# EAGLE design BlinkyTile_controller (EAGLE 7.1.0)
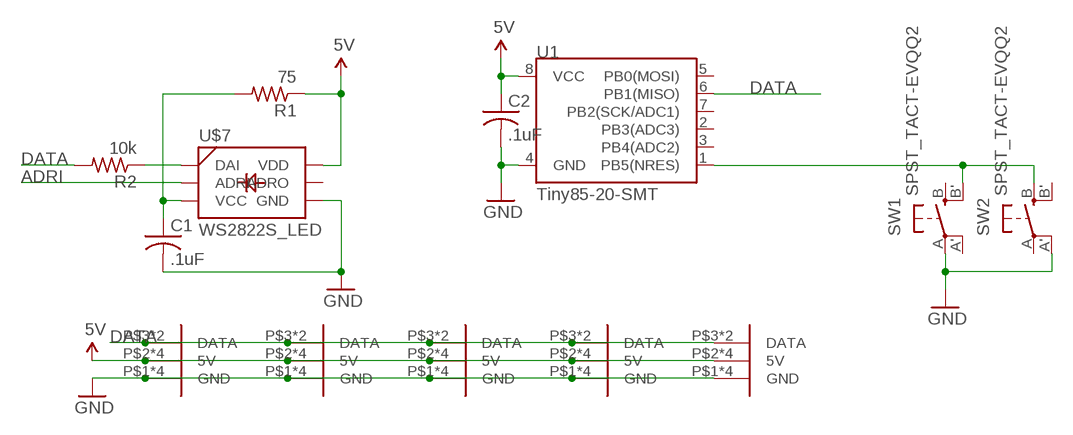
[diagram p0: schematic, sheet 1]

## Parts
C1  .1uF  C-USC0603  [C0603]
C2  .1uF  C-USC0603  [C0603]
R1  75  R-US_R0603  [R0603]
R2  10k  R-US_R0603  [R0603]
SW1  SPST_TACT-EVQQ2  [EVQ-Q2]
SW2  SPST_TACT-EVQQ2  [EVQ-Q2]
U1  Tiny85-20-SMT  ATTINY45TINY85-20-SMT  [SO08-EIAJ]
U$2  D_EDGESLOT  [D_EDGE_SLOT]
U$3  D_EDGESLOT  [D_EDGE_SLOT]
U$4  D_EDGESLOT  [D_EDGE_SLOT]
U$5  D_EDGESLOT  [D_EDGE_SLOT]
U$6  D_EDGESLOT  [D_EDGE_SLOT]
U$7  WS2822S_LED  [WS2822S_LED]

## Nets
5V: C2.1 R1.1 U1.8(VCC) U$2.P$2(5V) U$2.P$4(5V) U$2.P$7(5V) U$2.P$9(5V) U$3.P$2(5V) U$3.P$4(5V) U$3.P$7(5V) U$3.P$9(5V) U$4.P$2(5V) U$4.P$4(5V) U$4.P$7(5V) U$4.P$9(5V) U$5.P$2(5V) U$5.P$4(5V) U$5.P$7(5V) U$5.P$9(5V) U$6.P$2(5V) U$6.P$4(5V) U$6.P$7(5V) U$6.P$9(5V) U$7.6(VDD)
ADRI: U$7.2(ADRI)
DATA: R2.2 U1.6(PB1(MISO)) U$2.P$3(DATA) U$2.P$8(DATA) U$3.P$3(DATA) U$3.P$8(DATA) U$4.P$3(DATA) U$4.P$8(DATA) U$5.P$3(DATA) U$5.P$8(DATA) U$6.P$3(DATA) U$6.P$8(DATA)
GND: C1.2 C2.2 SW1.A(P) SW2.A'(P1) U1.4(GND) U$2.P$1(GND) U$2.P$5(GND) U$2.P$6(GND) U$2.P$10(GND) U$3.P$1(GND) U$3.P$5(GND) U$3.P$6(GND) U$3.P$10(GND) U$4.P$1(GND) U$4.P$5(GND) U$4.P$6(GND) U$4.P$10(GND) U$5.P$1(GND) U$5.P$5(GND) U$5.P$6(GND) U$5.P$10(GND) U$6.P$1(GND) U$6.P$5(GND) U$6.P$6(GND) U$6.P$10(GND) U$7.4(GND)
N$1: C1.1 R1.2 U$7.3(VCC)
N$2: R2.1 U$7.1(DAI)
N$3: SW1.B'(S1) SW2.B(S) U1.1(PB5(NRES))
Unconnected: SW1.A'(P1) SW1.B(S) SW2.A(P) SW2.B'(S1) U1.2(PB3(ADC3)) U1.3(PB4(ADC2)) U1.5(PB0(MOSI)) U1.7(PB2(SCK/ADC1)) U$7.5(ADRO)

## Library data of the parts
C1 C2 = adafruit:C-US: CAPACITOR, American symbol
R1 R2 = adafruit:R-US_: RESISTOR, American symbol
SW1 SW2 = adafruit:SPST_TACT: SMT 6mm switch, EVQQ2 series http://www.ladyada.net/library/eagle
U1 = SparkFun-DigitalIC:ATTINY45: Atmel 8-pin 2/4/8kB flash uC; PROD_ID: IC-09092
U$2-U$6 = dodocohedreled:D_EDGE
U$7 = blinkinlabs:WS2822S_LED

## Board
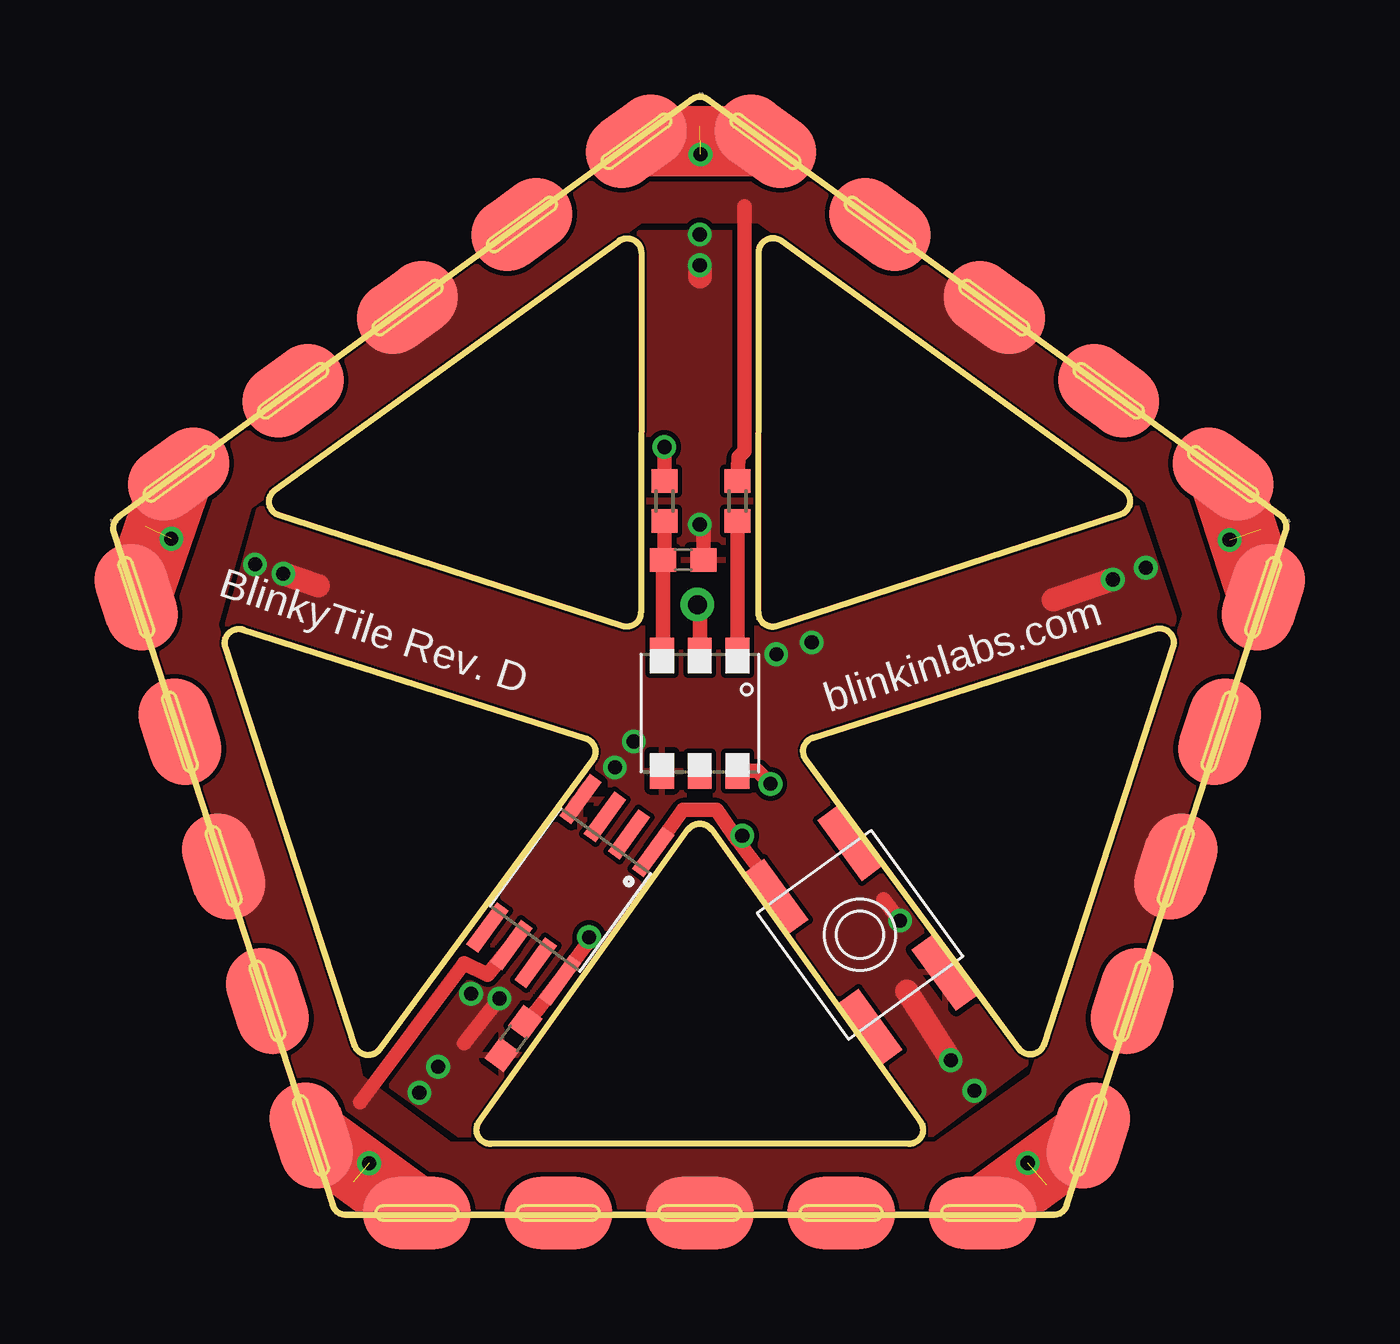
[diagram p1: board, top side]
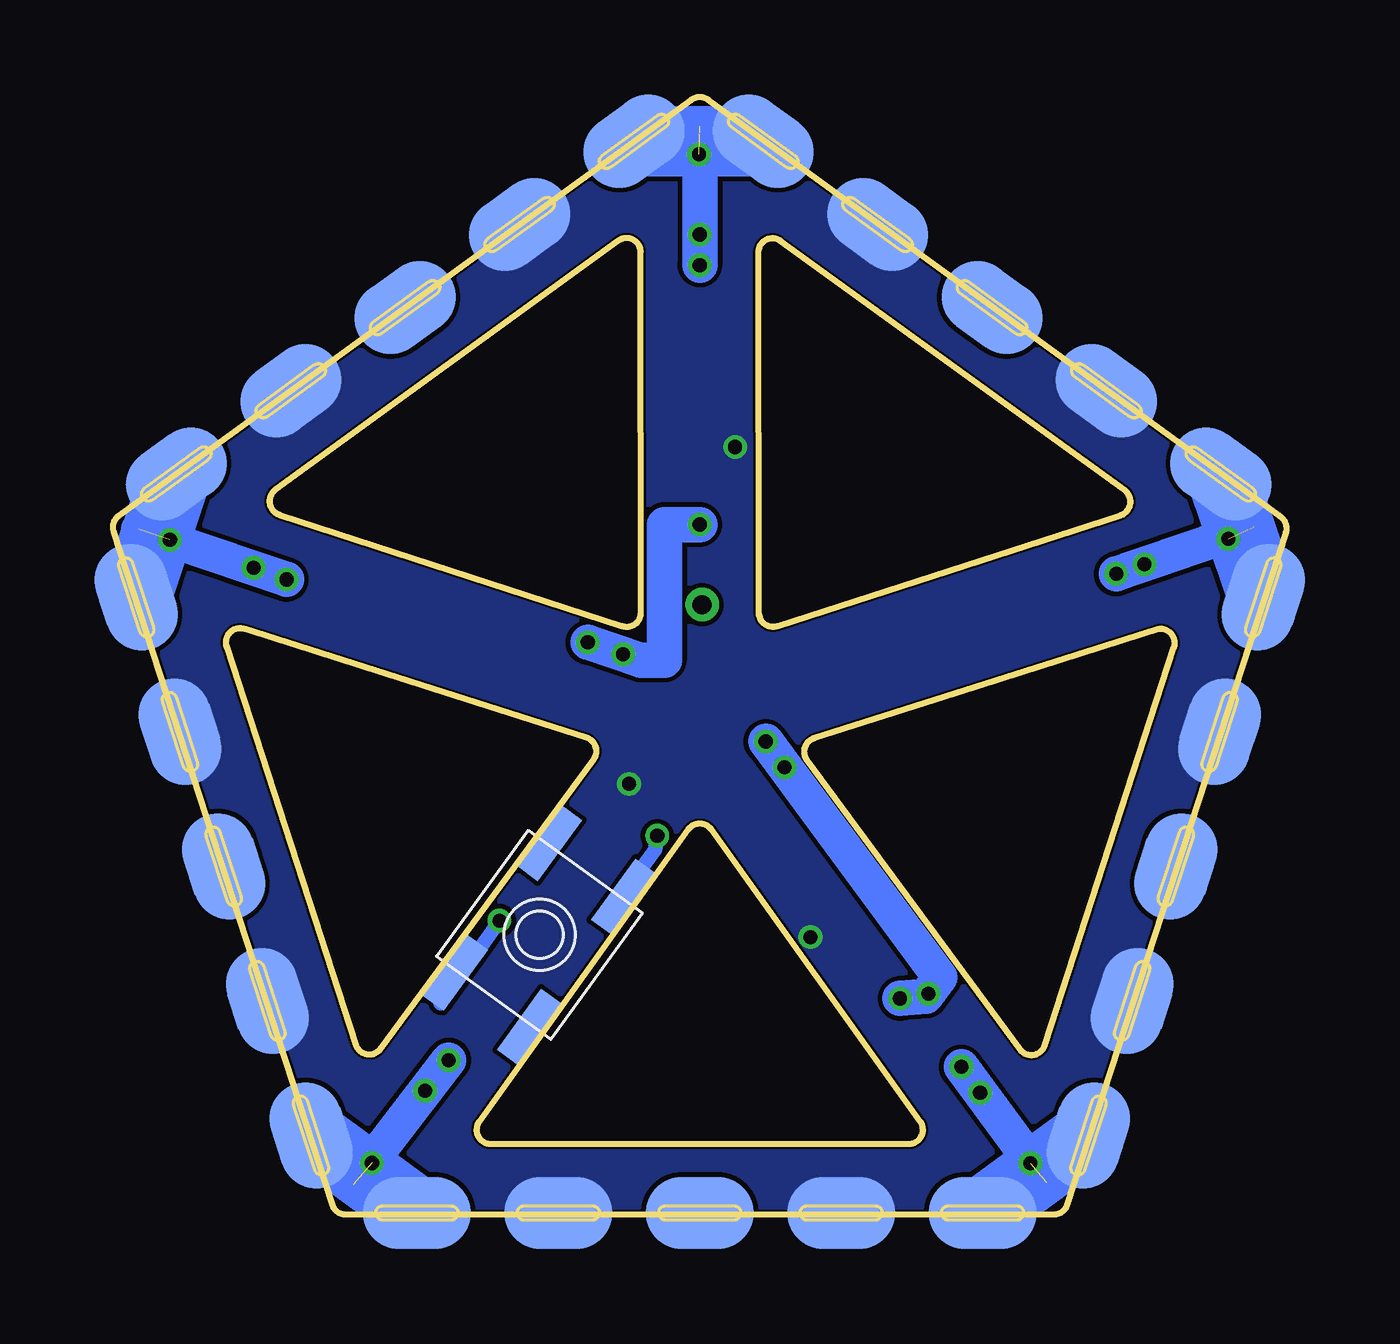
[diagram p2: board, bottom side, seen from below]

Size 49.79 x 47.41 mm. Coordinates in mm from the lower left corner, seen from the top.
Outline: 0.03,28.93 9.31,0.41 arc72 9.88,0 39.91,0 arc72 40.48,0.41 49.76,28.98 arc72 49.54,29.65 25.25,47.29 arc72 24.54,47.29 0.25,29.6 arc72 0.03,28.93
Outline: 15.53,3.95 24.41,16.34 arc-109 25.38,16.34 34.25,3.95 arc-126 33.77,3 16.02,3 arc-126 15.53,3.95
Outline: 38.44,7.04 29.4,19.3 arc-109 29.7,20.23 44.22,24.84 arc-126 44.97,24.08 39.49,7.21 arc-126 38.44,7.04
Outline: 5.52,24.81 20.05,20.2 arc-109 20.35,19.28 11.31,7.01 arc-126 10.25,7.18 4.77,24.06 arc-126 5.52,24.81
Outline: 22.41,40.81 22.39,25.54 arc-108 21.61,24.96 7.04,29.67 arc-126 6.87,30.73 21.46,41.3 arc-126 22.41,40.81
Outline: 42.74,29.69 28.18,24.96 arc-108 27.39,25.53 27.4,40.82 arc-126 28.35,41.31 42.9,30.75 arc-126 42.74,29.69
Copper layers (1*16): Top 0.035mm / dielectric 1.5mm / Bottom 0.035mm
Design rules "default *": minimum track width 10mil, minimum drill 0.6mm, track to track 8mil, track to pad 8mil, pad to pad 8mil, via to via 8mil, smd to smd 8mil, copper to edge 0.1mm, drill to drill 8mil, minimum pad ring 10mil, minimum via ring 8mil, stop-mask expansion 4mil, vias tented up to drill 0.6mm, thermal gap 10mil
tRestrict: area 22.9,24.3 to 26.9,27.3

### Footprints (pad centres in the part's own frame; a part is rotated, then mirrored left to right if it is on the bottom)
C0603 = smd 1.1 x 1: 1 -0.85,0; 2 0.85,0
R0603 = smd 1 x 1.1: 1 -0.85,0; 2 0.85,0
EVQ-Q2 = smd 3.2 x 1.2: A -3.4,-2; A' 3.4,-2; B -3.4,2; B' 3.4,2
SO08-EIAJ = smd 0.61 x 2.21: 1 -1.905,-3.378; 2 -0.635,-3.378; 3 0.635,-3.378; 4 1.905,-3.378; 5 1.905,3.353; 6 0.635,3.353; 7 -0.635,3.353; 8 -1.905,3.353
D_EDGE_SLOT = smd 4.572 x 3.048: P$1 -12,0; P$2 -6,0; P$3 0,0; P$4 6,0; P$5 12,0 | smd 4.572 x 3.048 bottom: P$6 -12,0; P$7 -6,0; P$8 0,0; P$9 6,0; P$10 12,0
WS2822S_LED = smd 1.5 x 1: 1 -2.45,1.6; 2 -2.45,0; 3 -2.45,-1.6; 4 2.45,-1.6; 5 2.45,0; 6 2.45,1.6

### Placement (x,y rotation side)
C1  24.19,27.77 0 top
C2  16.99,7.47 234 top
R1  23.39,30.27 270 top
R2  26.49,30.27 90 top
SW1  31.69,11.87 126 top
SW2  31.69,11.87 234 bottom
U1  19.39,13.77 144 top
U$2  24.89,0.07 0 top
U$3  45.09,14.77 72 top
U$4  4.69,14.77 288 top
U$5  37.39,38.47 144 top
U$6  12.49,38.47 216 top
U$7  24.89,21.27 270 top

### Tracks (layer width: path | path; a pad name or v marks a point on that pad's centre or on a via)
5V  (via drill 0.6)  (10 unrouted)
  Top 0.61: U$7.6 27.34,18.82 v27.89,18.27 | R1.1 v23.39,32.56 | v20.19,11.77 20.09,11.47 U1.8 17.99,8.67 C2.1
  pour Bottom: 9.44,0 -0.11,29.39 24.89,47.55 49.89,29.39 40.34,0
ADRI  (via drill 0.8 pad 1.42)
  Top 0.61: U$7.2 24.89,25.77 v24.79,25.87
DATA  (5 unrouted)
  Top 0.61: R2.2 26.54,32.12 26.79,32.37 26.79,42.77 | U1.6 15.89,10.17 14.89,10.67 10.49,4.77
  pour Top: 9.49,0.07 40.39,-0.03 49.89,29.37 24.89,47.57 -0.11,29.27 7.59,5.57 10.32,6.75 4.34,25.01 5.78,30.03 22.39,42.17 27.39,42.17 43.89,30.27 45.49,25.47 38.99,5.87 34.89,2.97 14.29,2.97 10.29,5.97 7.89,4.67
GND  (via drill 0.6)  (10 unrouted)
  Top 0.61: C1.2 25.04,29.12 v24.89,29.27 | v33.39,12.47 32.69,13.37 | v16.39,9.17 14.89,7.27
  Top 1: v24.89,40.27 24.89,39.77 | v42.42,26.94 39.89,26.07 | v35.54,6.55 33.69,9.47 | v7.22,27.18 8.69,26.67
  Top 3: U$6.P$6 U$5.P$10 | U$6.P$10 U$4.P$6 | U$4.P$10 U$2.P$6 | U$2.P$10 U$3.P$6 | U$5.P$6 U$3.P$10
  Bottom 0.61: SW2.A' 35.89,8.97 v33.39,12.47
  Bottom 1: U$6.P$6 24.89,46.17 | U$5.P$6 48.69,29.07 | U$2.P$10 39.59,1.27 | U$2.P$6 10.19,1.37 | U$6.P$10 1.39,29.17
  Bottom 1.5: 24.89,46.17 v24.89,40.27 | 48.69,29.07 v42.42,26.94 | 39.59,1.27 v35.54,6.55 | 10.19,1.37 v13.79,6.27 | 1.39,29.17 v7.22,27.18 | v24.89,29.27 26.39,29.27 26.39,23.52 27.39,23.52 v29.64,24.27 | v22.09,20.07 14.69,10.07 15.29,9.27 v16.39,9.17
  Bottom 3: U$4.P$10 U$2.P$6 | U$2.P$10 U$3.P$6 | U$3.P$10 U$5.P$6 | U$5.P$10 U$6.P$6 | U$4.P$6 U$6.P$10
  other vias: 24.89,41.57 43.82,27.44 36.54,5.25 12.99,5.17 6.02,27.58 10.86,2.18 2.47,28.67 24.92,44.97 47.37,28.62 38.8,2.19 28.14,23.77 15.19,9.37 21.29,18.97
  pour Top: 11.04,6 4.79,24.76 6.19,29.88 22.39,41.67 27.39,41.65 43.39,30.07 45.01,25.27 38.69,6.37 34.74,3.4 14.69,3.37
N$1
  Top 0.61: U$7.3 23.34,23.77 C1.1 23.39,27.82 R1.2
N$2
  Top 0.61: R2.1 U$7.1
N$3  (via drill 0.6)
  Top 0.61: U1.1 24.19,17.17 25.59,17.17 26.49,15.87 | v26.69,16.07 26.49,15.87 | 26.49,15.87 28.09,13.77 SW1.B'
  Bottom 0.61: SW1.B' 28.09,13.67 26.79,15.47 v26.69,16.07
N$4
  pour Top: 7.89,7.27 10.04,7.98 10.54,5.48 8.39,3.77

### Text on the board
tNames: BlinkyTile Rev. D | blinkinlabs.com